# Altium schematic sheet 21_KEY_E.SchDoc: C200
size 439 x 311 mm; Page Create Date: March  8, 1995; Page Number: 21; Page Size: Custom; Comment: radxa_1010; Page Count: 21; RevCode: V1.11; Doc: 21_KEY_E; DsnPath: D:\WMS\C200\CC122\对外\C200 V1.11.DSN; SchematicName: c200; PageName: 21_KEY_E; PageSize: Custom; TopSchematic: True
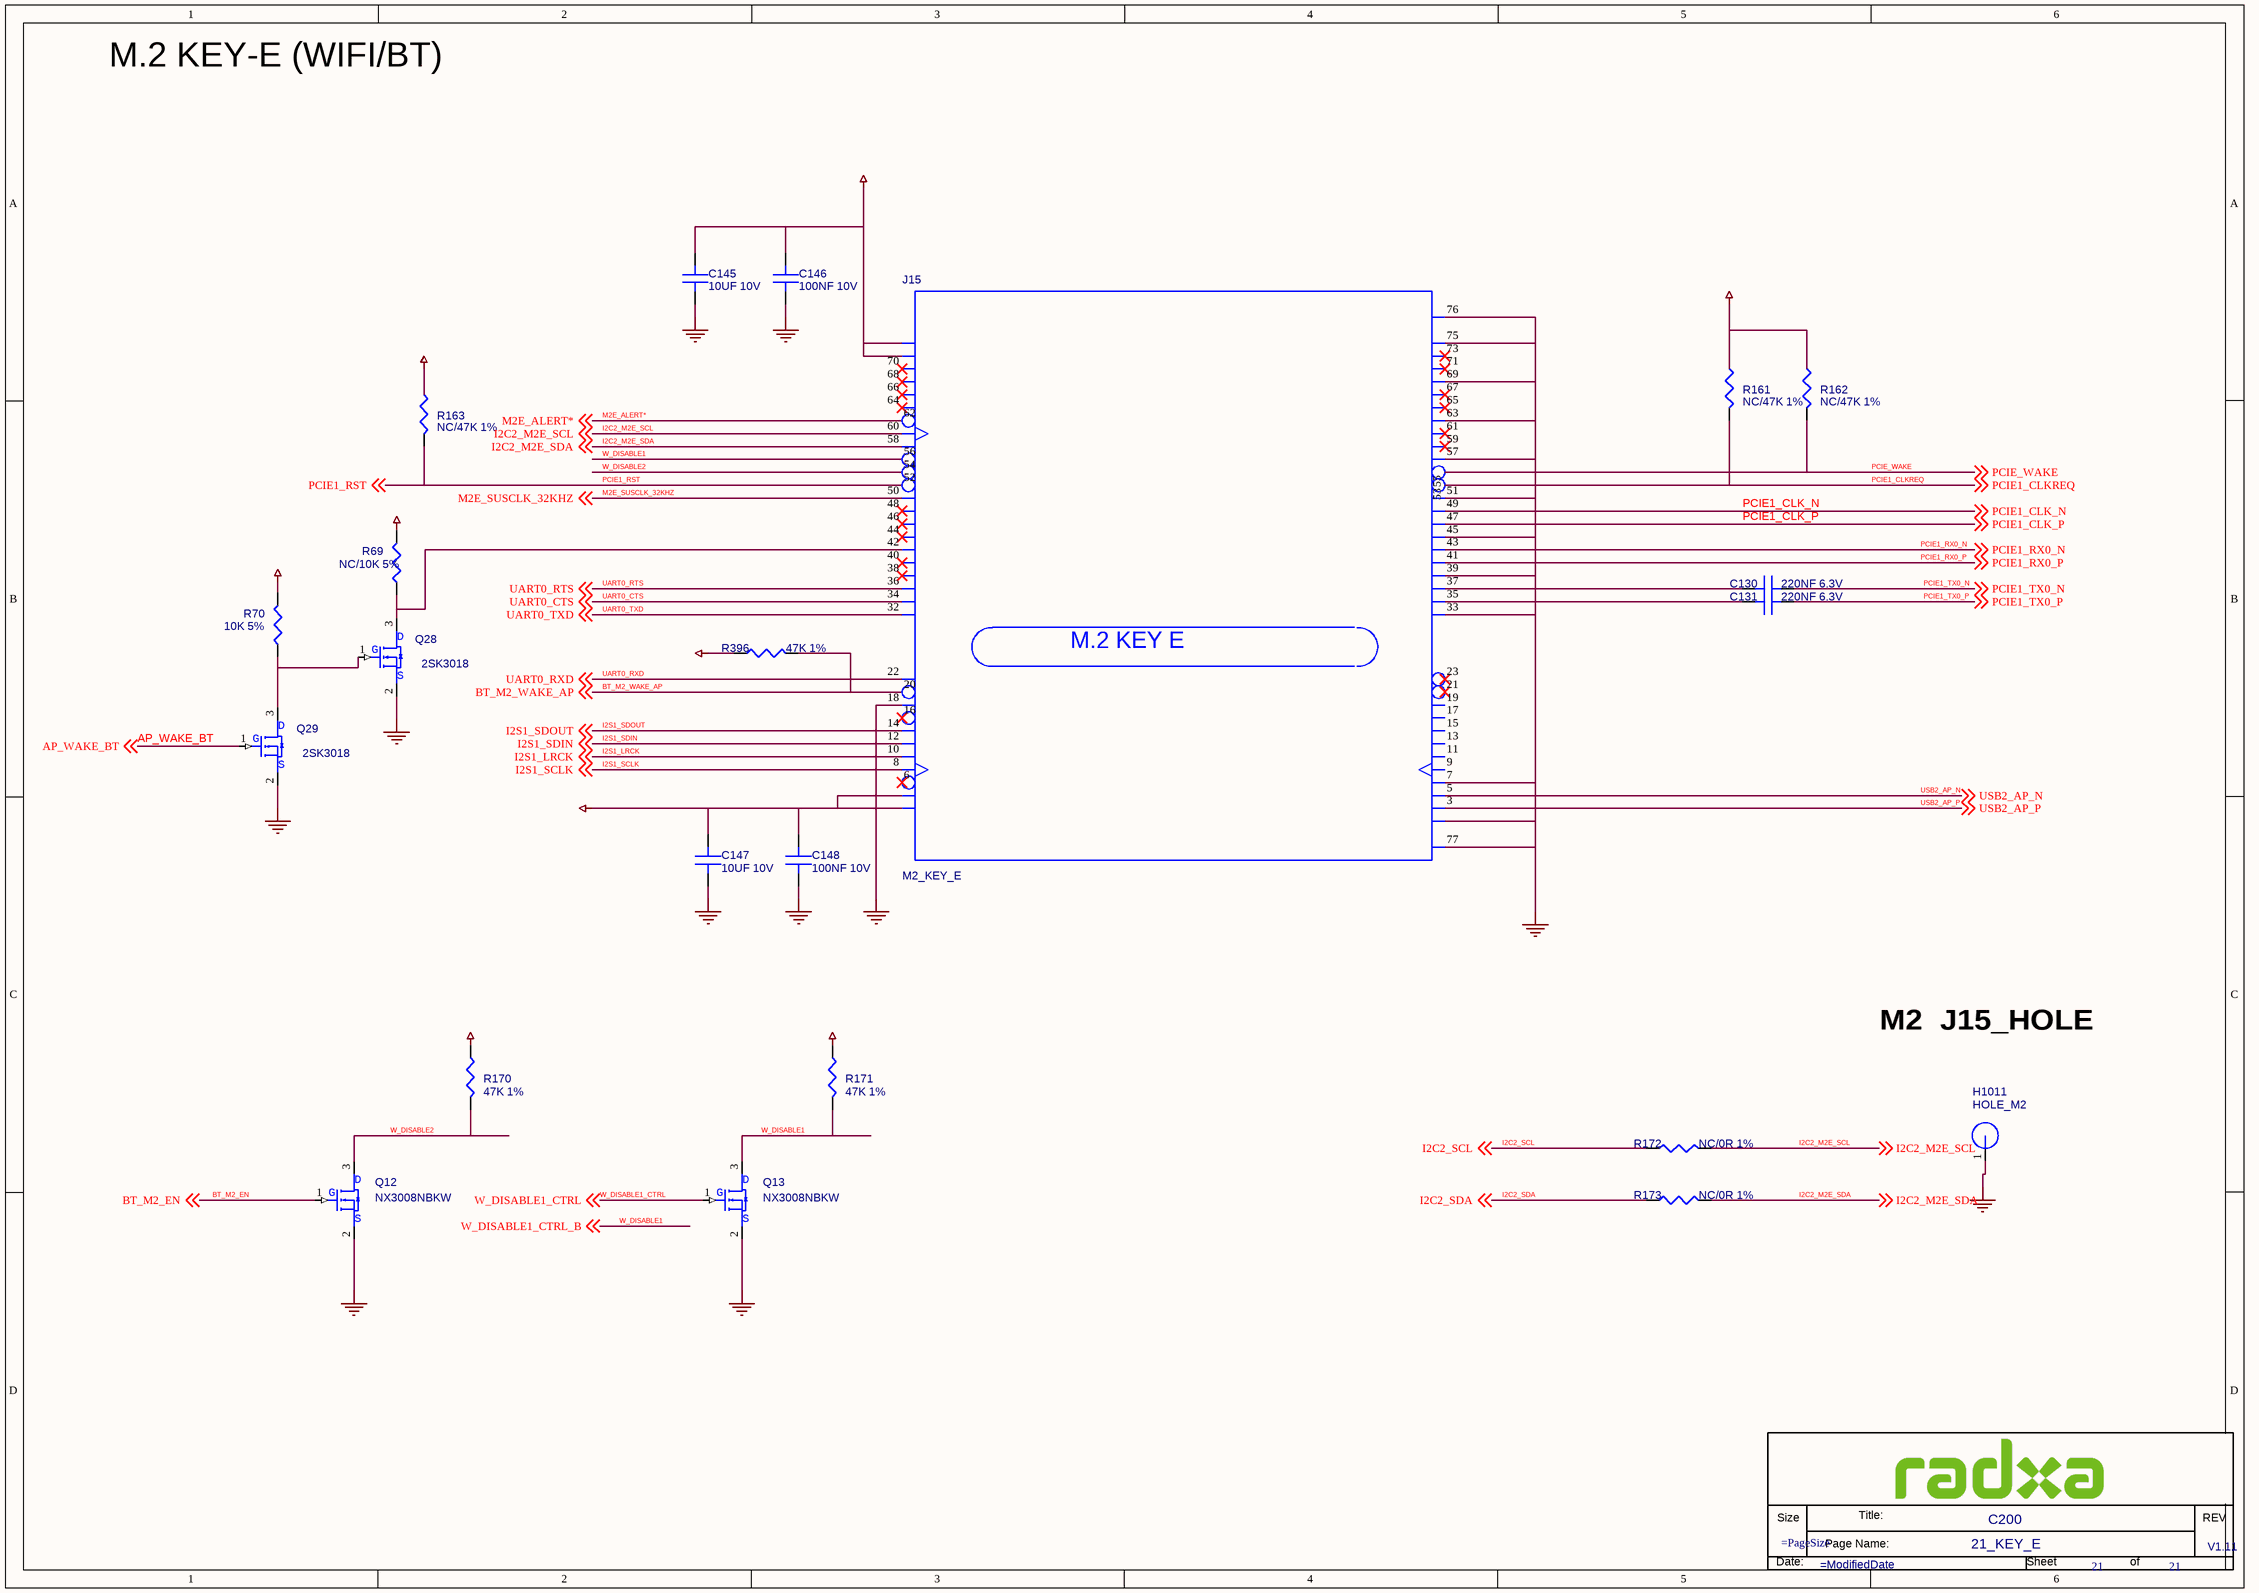
[diagram p0: 21_KEY_E.SchDoc]

## Parts
*  Doc: 21_KEY_E  RevCode: V1.11  Title: C200  Page Number: 21  (hidden comment: radxa_1010)  (graphical)
C130  220NF 6.3V  [C0201]
C131  220NF 6.3V  [C0201]
C145  10UF 10V  [C0603]
C146  100NF 10V  [C0402]
C147  10UF 10V  [C0603]
C148  100NF 10V  [C0402]
H1011  HOLE_M2  [H3.8MM]
J15  M2_KEY_E  [PCIE_E_KEY_SM75_0D5_30]
Q12  NX3008NBKW  [SOT_323]
Q13  NX3008NBKW  [SOT_323]
Q28  2SK3018  [SOT_323]
Q29  2SK3018  [SOT_323]
R69  NC/10K 5%  [R0402]
R70  10K 5%  [R0402]
R161  NC/47K 1%  [R0402]
R162  NC/47K 1%  [R0402]
R163  NC/47K 1%  [R0402]
R170  47K 1%  [R0402]
R171  47K 1%  [R0402]
R172  NC/0R 1%  [R0402]
R173  NC/0R 1%  [R0402]
R396  47K 1%  [R0402]

## Nets
3P3V_1: J15.74(3P3V_1)
3P3V_2: J15.72(3P3V_2)
3P3V_3: J15.4(3P3V_3)
3P3V_4: J15.2(3P3V_4)
GND: C145.2(B) C146.2(B) C147.2(B) C148.2(B) H1011.1 J15.7(GND_10) J15.18(GND_9) J15.33(GND_8) J15.39(GND_7) J15.45(GND_6) J15.51(GND_5) J15.57(GND_4) J15.63(GND_3) J15.69(GND_2) J15.75(GND_1) J15.76(GND_13) J15.77(GND_12) Q12.2(S) Q13.2(S) Q28.2(S) Q29.2(S)
GND_11: J15.1(GND_11)
VDD_1V8: R69.1 R70.1
VDD_3V3_SYS: C145.1(A) C146.1(A) C147.1(A) C148.1(A) R161.1 R162.1 R163.1 R170.1 R171.1 R396.1
AP_WAKE_BT: Q29.1(G) ; off-sheet AP_WAKE_BT
BT_M2_EN: Q12.1(G) ; off-sheet BT_M2_EN
BT_M2_WAKE_AP: J15.20(UART_WAKE*) R396.2 ; off-sheet BT_M2_WAKE_AP
I2C2_M2E_SCL: J15.60(I2C_CLK) R172.2 ; off-sheet I2C2_M2E_SCL
I2C2_M2E_SDA: J15.58(I2C_DATA) R173.2 ; off-sheet I2C2_M2E_SDA
I2C2_SCL: R172.1 ; off-sheet I2C2_SCL
I2C2_SDA: R173.1 ; off-sheet I2C2_SDA
I2S1_LRCK: J15.10(PCM_SYNC_125_WS) ; off-sheet I2S1_LRCK
I2S1_SCLK: J15.8(PCM_CLK_12S_SCK) ; off-sheet I2S1_SCLK
I2S1_SDIN: J15.12(PCM_IN_12S_SD_IN) ; off-sheet I2S1_SDIN
I2S1_SDOUT: J15.14(PCM_OUT_12S_SD_OUT) ; off-sheet I2S1_SDOUT
M2E_ALERT*: J15.62(ALERT*) ; off-sheet M2E_ALERT*
M2E_SUSCLK_32KHZ: J15.50(SUSCLK_32KHZ) ; off-sheet M2E_SUSCLK_32KHZ
PCIE1_CLK_N: J15.49(REFCLKNO) ; off-sheet PCIE1_CLK_N
PCIE1_CLK_P: J15.47(REFCLKPO) ; off-sheet PCIE1_CLK_P
PCIE1_CLKREQ: J15.53(CLKREQO*) R161.2 ; off-sheet PCIE1_CLKREQ
PCIE1_RST: J15.52(PERST0*) R163.2 ; off-sheet PCIE1_RST
PCIE1_RX0_N: J15.43(PERNO) ; off-sheet PCIE1_RX0_N
PCIE1_RX0_P: J15.41(PERPO) ; off-sheet PCIE1_RX0_P
PCIE1_TX0_N: C130.2(B) ; off-sheet PCIE1_TX0_N
PCIE1_TX0_P: C131.2(B) ; off-sheet PCIE1_TX0_P
PCIE_WAKE: J15.55(PEWAKEO*) R162.2 ; off-sheet PCIE_WAKE
UART0_CTS: J15.34(UART_CTS) ; off-sheet UART0_CTS
UART0_RTS: J15.36(UART_RTS) ; off-sheet UART0_RTS
UART0_RXD: J15.22(UART_RXD) ; off-sheet UART0_RXD
UART0_TXD: J15.32(UART_TXD) ; off-sheet UART0_TXD
USB2_AP_N: J15.5(USB_DM) ; off-sheet USB2_AP_N
USB2_AP_P: J15.3(USB_DP) ; off-sheet USB2_AP_P
W_DISABLE1: J15.56(W_DISABLE1*) Q13.3(D) R171.2 ; off-sheet W_DISABLE1_CTRL_B  [also labelled W_DISABLE1_CTRL_B]
W_DISABLE1_CTRL: Q13.1(G) ; off-sheet W_DISABLE1_CTRL
W_DISABLE2: J15.54(W_DISABLE2*) Q12.3(D) R170.2
NetC130_1: C130.1(A) J15.37(PETNO)
NetC131_1: C131.1(A) J15.35(PETPO)
NetJ15_42: J15.42(VENDOR_DEFINED_1) Q28.3(D) R69.2
NetQ28_1: Q28.1(G) Q29.3(D) R70.2

Not connected (* = marked no-connect by the designer): J15 6(LED1*)* 9(SDIO_CLK) 11(SDIO_CMD) 13(SDIO_DATAO) 15(SDIO_DATA1) 16(LED2*)* 17(SDIO_DATA2) 19(SDIO_DATA3) 21(SDIO_WAKE*)* 23(SDIO_RESET*)* 38(VENDOR_DEFINED_3)* 40(VENDOR_DEFINED_2)* 44(COEX3)* 46(COEX2)* 48(COEX1)* 59(RESERVED_PETP1)* 61(RESERVED_PETN1)* 64(RESERVED)* 65(RESERVED_PERP1)* 66(UIM_SWP_PERST1*)* 67(RESERVED_PERN1)* 68(UIM_POWER_SNK_CLKREQ1*)* 70(UIM_POWER_SRC_GPIO1_PEWAKE1*)* 71(RESERVED_REFCLKP1)* 73(RESERVED_REFCLKN1)*

## Notes on the sheet
- M.2 KEY-E (WIFI/BT)
- M2  J15_HOLE
- (in symbol M2_KEY_E) M.2 KEY E
- (in symbol radxa_1010) Size; Title:; REV; Page Name:; Date:; Sheet; of

## Library data of the parts
C130 = C: SMD  0201  220NF  6.3V  X5R  ±20%  ROHS; PARTS: 1; Part Reference: C130; Part Number: A1C01.00128; OriginalSymbolOrigin: (0,30); PKG_TYPE: CAP2-100-250; LEVEL: STD; PINSWAP: (A,B); Value: 220NF 6.3V; Part Type: 陶瓷电容; PCB Footprint: C0201
C131 = C: SMD  0201  220NF  6.3V  X5R  ±20%  ROHS; PARTS: 1; Part Reference: C131; Part Number: A1C01.00128; OriginalSymbolOrigin: (0,30); PKG_TYPE: CAP2-100-250; LEVEL: STD; PINSWAP: (A,B); Value: 220NF 6.3V; Part Type: 陶瓷电容; PCB Footprint: C0201
C145 = C: SMD  0603  10UF  10V  X5R  ±10%  ROHS; PARTS: 1; Part Reference: C145; Part Number: A1C01.00270; OriginalSymbolOrigin: (0,30); PKG_TYPE: CAP2-100-250; LEVEL: STD; PINSWAP: (A,B); Value: 10UF 10V; Part Type: 陶瓷电容; PCB Footprint: C0603
C146 = C: SMD  0402  100NF  10V  X5R  ±10%  ROHS; PARTS: 1; Part Reference: C146; Part Number: A1C01.00163; OriginalSymbolOrigin: (0,30); PKG_TYPE: CAP2-100-250; LEVEL: STD; PINSWAP: (A,B); Value: 100NF 10V; Part Type: 陶瓷电容; PCB Footprint: C0402
C147 = C: SMD  0603  10UF  10V  X5R  ±10%  ROHS; PARTS: 1; Part Reference: C147; Part Number: A1C01.00270; OriginalSymbolOrigin: (0,30); PKG_TYPE: CAP2-100-250; LEVEL: STD; PINSWAP: (A,B); Value: 10UF 10V; Part Type: 陶瓷电容; PCB Footprint: C0603
C148 = C: SMD  0402  100NF  10V  X5R  ±10%  ROHS; PARTS: 1; Part Reference: C148; Part Number: A1C01.00163; OriginalSymbolOrigin: (0,30); PKG_TYPE: CAP2-100-250; LEVEL: STD; PINSWAP: (A,B); Value: 100NF 10V; Part Type: 陶瓷电容; PCB Footprint: C0402
H1011 = HOLE: Part Reference: H1011; PCB Footprint: HOLE_2D7_6D0_A; RK PN: HOLE_3R50; Priority: A; Value: HOLE_M2; Part Type: HOLE
J15 = M2_KEY_E: SMD  母座  75PIN  180度  M.2  E  KEY  H4.2mm  0.5mm脚距  APCI0108-P001A  黑色  LOTES  ROHS; Part Reference: J15; Part Number: A1J01.00042; OriginalSymbolOrigin: (-1050,1100); ANGLE: ?; ASSEMBLY: ?; EMI_GROUND_TAB: ?; GENDER: ?; LATCHING: ?; MAX_CURRENT: ?; MAX_VOLTAGE: ?; NV_NAME: ?; NV_PN: ?; PACK_TYPE: ?; PATH: ?; PITCH: ?; PLACEMENT_NOTE: ?; REFLOW: ?; SHIELDED: ?; SHROUDED: ?; SKU: COMMON; Value: M2_KEY_E; Part Type: 连接座; PCB Footprint: PCIE_E_KEY_SM75_0D5_30
Q12 = MOSFET_NPN: SMD  编带  SOT-323  NX3008NBKW  N沟道  Nexperia(安世)  ROHS; Part Reference: Q12; Part Number: A1D01.00070; Temp Coeff: -55℃ to ＋150℃; Value: NX3008NBKW; Part Type: 三极管-MOS管; PCB Footprint: SOT_323
Q13 = MOSFET_NPN: SMD  编带  SOT-323  NX3008NBKW  N沟道  Nexperia(安世)  ROHS; Part Reference: Q13; Part Number: A1D01.00070; Temp Coeff: -55℃ to ＋150℃; Value: NX3008NBKW; Part Type: 三极管-MOS管; PCB Footprint: SOT_323
Q28 = MOSFET_NPN: SMD  编带  SOT-323  2SK3018  N沟道  长晶  ROHS; Part Reference: Q28; Part Number: A1D01.00007; Temp Coeff: -55℃ to ＋150℃; Value: 2SK3018; Part Type: 三极管-MOS管; PCB Footprint: SOT_323
Q29 = MOSFET_NPN: SMD  编带  SOT-323  2SK3018  N沟道  长晶  ROHS; Part Reference: Q29; Part Number: A1D01.00007; Temp Coeff: -55℃ to ＋150℃; Value: 2SK3018; Part Type: 三极管-MOS管; PCB Footprint: SOT_323
R69 = R: SMD  0201  10K  1/20W  ±5%  ROHS; Part Reference: R69; Part Number: A1R01.00012; PCB Footprint: R0201; Temp Coeff: －55℃ ~ ＋125℃; Value: NC/10K 5%; Part Type: 贴片电阻
R70 = R: SMD  0201  10K  1/20W  ±5%  ROHS; Part Reference: R70; Part Number: A1R01.00012; PCB Footprint: R0201; Temp Coeff: －55℃ ~ ＋125℃; Value: 10K 5%; Part Type: 贴片电阻
R161 = R: SMD  0402  47K  1/16W  ±1%  ROHS; Part Reference: R161; CDS_PART_NAME: R_0402-47K,5 %,62.5MW,195-0599-000; CDS_PHYS_PART_NAME: R_0402-47K,5 %,62.5MW,195-0599-000-195-0599-000,47K; Part Number: A1R01.00248; ASSEMBLY: M2_WIFIBT; CDS_LIB: discrete; CDS_SEC: 1; DEVICE_TYPENAME: R_0402-47K5625MW195-0599-000-195-0599-00047K; DRAWING: #NAME?; MAX_WATTAGE: 62.5mW; NV_PN: 195-0599-000; PACK_TYPE: 402; PATH: I15; PHYS_PAGE: 20; ROT: 0; SIGNAL_MODEL: nv_res; TOL: 5%; VER: 2; XY: (-3650,5800); PCB Footprint: R0402; Value: NC/47K 1%; CHIPS_PART_NAME: R; SKU: DNI; SEC: 1; Part Type: 贴片电阻
R162 = R: SMD  0402  47K  1/16W  ±1%  ROHS; Part Reference: R162; CDS_PART_NAME: R_0402-47K,5 %,62.5MW,195-0599-000; CDS_PHYS_PART_NAME: R_0402-47K,5 %,62.5MW,195-0599-000-195-0599-000,47K; Part Number: A1R01.00248; ASSEMBLY: M2_WIFIBT; CDS_LIB: discrete; CDS_SEC: 1; DEVICE_TYPENAME: R_0402-47K5625MW195-0599-000-195-0599-00047K; DRAWING: #NAME?; MAX_WATTAGE: 62.5mW; NV_PN: 195-0599-000; PACK_TYPE: 402; PATH: I14; PHYS_PAGE: 20; ROT: 0; SIGNAL_MODEL: nv_res; TOL: 5%; VER: 2; XY: (-3350,5800); PCB Footprint: R0402; Value: NC/47K 1%; CHIPS_PART_NAME: R; SKU: DNI; SEC: 1; Part Type: 贴片电阻
R163 = R: SMD  0402  47K  1/16W  ±1%  ROHS; Part Reference: R163; Part Number: A1R01.00248; CDS_PHYS_PART_NAME: R_0402-47K,5 %,62.5MW,195-0599-000-195-0599-000,47K; CDS_PART_NAME: R_0402-47K,5 %,62.5MW,195-0599-000; SEC: 1; XY: (-9350,5700); VER: 2; TOL: 5%; SIGNAL_MODEL: nv_res; ROT: 0; PHYS_PAGE: 20; PATH: I52; PACK_TYPE: 402; NV_PN: 195-0599-000; MAX_WATTAGE: 62.5mW; DRAWING: #NAME?; DEVICE_TYPENAME: R_0402-47K5625MW195-0599-000-195-0599-00047K; CDS_LIB: discrete; ASSEMBLY: M2_WIFIBT; PCB Footprint: R0402; Value: NC/47K 1%; Part Type: 贴片电阻; SKU: DNI; CHIPS_PART_NAME: R; CDS_SEC: 1
R170 = R: SMD  0402  47K  1/16W  ±1%  ROHS; Part Reference: R170; Part Number: A1R01.00248; CDS_PHYS_PART_NAME: R_0402-47K,5 %,62.5MW,195-0599-000-195-0599-000,47K; CDS_PART_NAME: R_0402-47K,5 %,62.5MW,195-0599-000; SEC: 1; XY: (-9600,2950); VER: 2; TOL: 5%; SIGNAL_MODEL: nv_res; ROT: 0; PHYS_PAGE: 20; PATH: I72; PACK_TYPE: 402; NV_PN: 195-0599-000; MAX_WATTAGE: 62.5mW; DRAWING: #NAME?; DEVICE_TYPENAME: R_0402-47K5625MW195-0599-000-195-0599-00047K; CDS_LIB: discrete; ASSEMBLY: M2_WIFIBT; PCB Footprint: R0402; Value: 47K 1%; Part Type: 贴片电阻; CHIPS_PART_NAME: R; CDS_SEC: 1
R171 = R: SMD  0402  47K  1/16W  ±1%  ROHS; Part Reference: R171; Part Number: A1R01.00248; CDS_PART_NAME: R_0402-47K,5 %,62.5MW,195-0599-000; CDS_PHYS_PART_NAME: R_0402-47K,5 %,62.5MW,195-0599-000-195-0599-000,47K; ASSEMBLY: M2_WIFIBT; CDS_LIB: discrete; CDS_SEC: 1; DEVICE_TYPENAME: R_0402-47K5625MW195-0599-000-195-0599-00047K; DRAWING: #NAME?; MAX_WATTAGE: 62.5mW; NV_PN: 195-0599-000; PACK_TYPE: 402; PATH: I43; PHYS_PAGE: 20; ROT: 0; SIGNAL_MODEL: nv_res; TOL: 5%; VER: 2; XY: (-7200,2950); PCB Footprint: R0402; Value: 47K 1%; Part Type: 贴片电阻; CHIPS_PART_NAME: R; SEC: 1
R172 = R: SMD  0402  0R  1/16W  ±1%  ROHS; Part Reference: R172; Part Number: A1R01.00219; PCB Footprint: R0402; Value: NC/0R 1%; Part Type: 贴片电阻
R173 = R: SMD  0402  0R  1/16W  ±1%  ROHS; Part Reference: R173; Part Number: A1R01.00219; PCB Footprint: R0402; Value: NC/0R 1%; Part Type: 贴片电阻
R396 = R: SMD  0402  47K  1/16W  ±1%  ROHS; Part Reference: R396; Part Number: A1R01.00248; PCB Footprint: R0402; Value: 47K 1%; Part Type: 贴片电阻
* = radxa_1010: Page Create Date: March  8, 1995; Page Size: =PageSize; Page Count: 21; Page Modify Date: =ModifiedDate